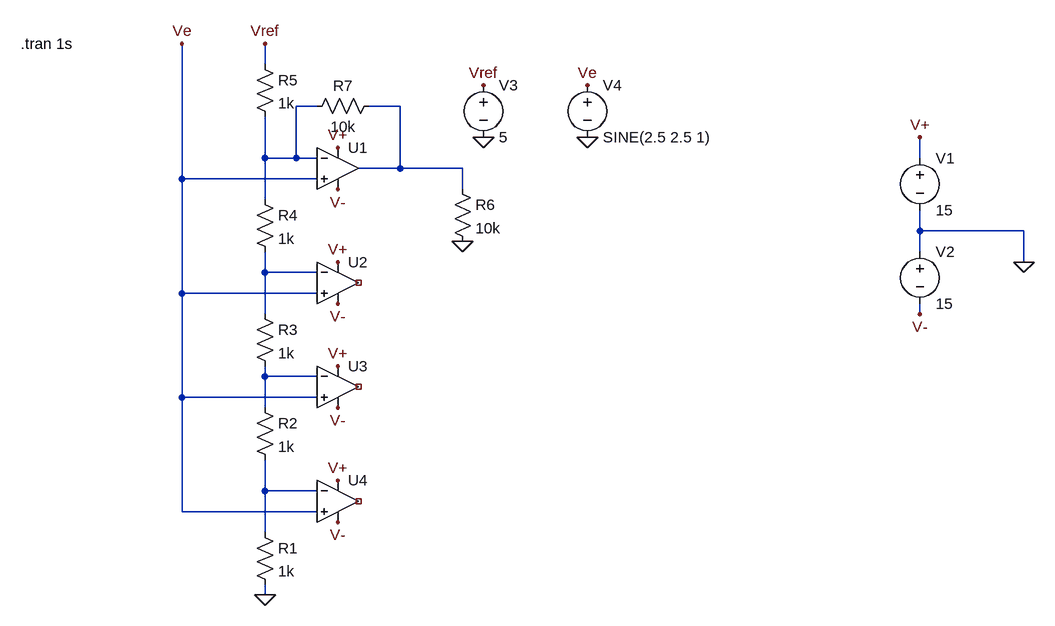
[diagram p0: schematic ADC.asc]
ADC.asc, the LTspice schematic file:
Version 4
SHEET 1 1152 800
WIRE -32 -32 -32 -64
WIRE 48 32 16 32
WIRE 176 32 128 32
WIRE -32 112 -32 48
WIRE 16 112 16 32
WIRE 16 112 -32 112
WIRE 48 112 16 112
WIRE 976 112 976 80
WIRE 176 128 176 32
WIRE 176 128 112 128
WIRE 272 128 176 128
WIRE -160 144 -160 -64
WIRE 48 144 -160 144
WIRE 272 160 272 128
WIRE -32 176 -32 112
WIRE 976 224 976 192
WIRE 1136 224 976 224
WIRE 976 256 976 224
WIRE 1136 272 1136 224
WIRE -32 288 -32 256
WIRE 48 288 -32 288
WIRE -160 320 -160 144
WIRE 48 320 -160 320
WIRE -32 352 -32 288
WIRE 976 352 976 336
WIRE -32 448 -32 432
WIRE 48 448 -32 448
WIRE -160 480 -160 320
WIRE 48 480 -160 480
WIRE -32 496 -32 448
WIRE -32 624 -32 576
WIRE 48 624 -32 624
WIRE -160 656 -160 480
WIRE 48 656 -160 656
WIRE -32 688 -32 624
WIRE -32 784 -32 768
FLAG 1136 272 0
FLAG 976 80 V+
FLAG 976 352 V-
FLAG 80 96 V+
FLAG 80 160 V-
FLAG 80 272 V+
FLAG 80 336 V-
FLAG 80 432 V+
FLAG 80 496 V-
FLAG 80 608 V+
FLAG 80 672 V-
FLAG -32 784 0
FLAG -32 -64 Vref
FLAG -160 -64 Ve
FLAG 304 0 Vref
FLAG 464 0 Ve
FLAG 304 80 0
FLAG 464 80 0
FLAG 272 240 0
SYMBOL UniversalOpAmp 80 128 R0
SYMATTR InstName U1
SYMBOL Voltage 976 96 R0
SYMATTR InstName V1
SYMATTR Value 15
SYMBOL voltage 976 240 R0
SYMATTR InstName V2
SYMATTR Value 15
SYMBOL UniversalOpAmp 80 304 R0
SYMATTR InstName U2
SYMBOL UniversalOpAmp 80 464 R0
SYMATTR InstName U3
SYMBOL UniversalOpAmp 80 640 R0
SYMATTR InstName U4
SYMBOL Res -48 672 R0
SYMATTR InstName R1
SYMATTR Value 1k
SYMBOL Res -48 480 R0
SYMATTR InstName R2
SYMATTR Value 1k
SYMBOL Res -48 336 R0
SYMATTR InstName R3
SYMATTR Value 1k
SYMBOL Res -48 160 R0
SYMATTR InstName R4
SYMATTR Value 1k
SYMBOL Res -48 -48 R0
SYMATTR InstName R5
SYMATTR Value 1k
SYMBOL voltage 304 -16 R0
SYMATTR InstName V3
SYMATTR Value 5
SYMBOL voltage 464 -16 R0
SYMATTR InstName V4
SYMATTR Value SINE(2.5 2.5 1)
SYMBOL Res 256 144 R0
SYMATTR InstName R6
SYMATTR Value 10k
SYMBOL Res 144 16 R90
WINDOW 0 0 56 VBottom 2
WINDOW 3 32 56 VTop 2
SYMATTR InstName R7
SYMATTR Value 10k
TEXT -408 -64 Left 2 !.tran 1s

The netlist it stands for:
* ADC.asc
XU1 Ve N001 V+ V- N002 level1 Avol=1Meg GBW=10Meg Vos=0 En=0 Enk=0 In=0 Ink=0 Rin=500Meg  ; pins In+ In- V+ V- OUT
V1 V+ 0 15
V2 0 V- 15
XU2 Ve N003 V+ V- NC_01 level1 Avol=1Meg GBW=10Meg Vos=0 En=0 Enk=0 In=0 Ink=0 Rin=500Meg  ; pins In+ In- V+ V- OUT
XU3 Ve N004 V+ V- NC_02 level1 Avol=1Meg GBW=10Meg Vos=0 En=0 Enk=0 In=0 Ink=0 Rin=500Meg  ; pins In+ In- V+ V- OUT
XU4 Ve N005 V+ V- NC_03 level1 Avol=1Meg GBW=10Meg Vos=0 En=0 Enk=0 In=0 Ink=0 Rin=500Meg  ; pins In+ In- V+ V- OUT
R1 N005 0 1k
R2 N004 N005 1k
R3 N003 N004 1k
R4 N001 N003 1k
R5 Vref N001 1k
V3 Vref 0 5
V4 Ve 0 SINE(2.5 2.5 1)
R6 N002 0 10k
R7 N002 N001 10k
.tran 1s
.lib UniversalOpAmp1.lib
.backanno
.end